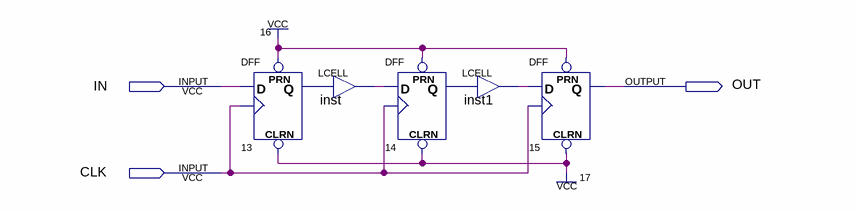
[diagram p0: schematic sheet]
// Quartus schematic sr3.bdf as structural Verilog: 5 symbols, 3 pins
module sr3 (
  input  IN,
  input  CLK,
  output OUT
);

  wire inst1_out, inst_out, n13_q, n14_q;

  DFF u_13 (.CLRN(1'b1), .CLK(CLK), .D(IN), .PRN(1'b1), .Q(n13_q));
  LCELL inst (.IN(n13_q), .OUT(inst_out));
  DFF u_14 (.CLRN(1'b1), .CLK(CLK), .D(inst_out), .PRN(1'b1), .Q(n14_q));
  LCELL inst1 (.IN(n14_q), .OUT(inst1_out));
  DFF u_15 (.CLRN(1'b1), .CLK(CLK), .D(inst1_out), .PRN(1'b1), .Q(OUT));
endmodule
